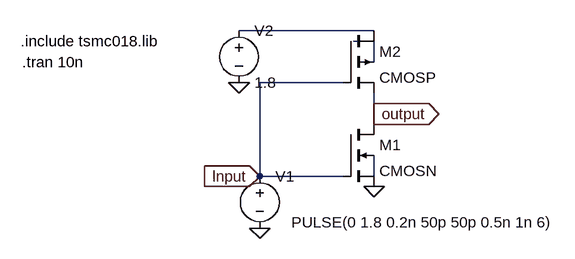
[diagram p0: schematic characteristic_of_cmos _inverter.asc]
characteristic_of_cmos _inverter.asc, the LTspice schematic file:
Version 4
SHEET 1 880 680
WIRE 224 -128 16 -128
WIRE 224 -112 192 -112
WIRE 224 -80 224 -112
WIRE 176 -48 48 -48
WIRE 224 0 224 -32
WIRE 224 16 224 0
WIRE 48 96 48 -48
WIRE 176 96 48 96
WIRE 224 96 224 64
FLAG 224 112 0
FLAG 16 -48 0
FLAG 48 176 0
FLAG 224 0 output
IOPIN 224 0 Out
FLAG 48 96 lnput
IOPIN 48 96 In
SYMBOL cmosn 176 16 R0
SYMATTR InstName M1
SYMATTR Value2 l=180n w=400n
SYMBOL cmosp 176 -128 R0
SYMATTR InstName M2
SYMATTR Value2 l=180n w=800n
SYMBOL voltage 48 80 R0
WINDOW 3 49 87 Left 2
WINDOW 123 0 0 Left 0
WINDOW 39 0 0 Left 0
SYMATTR InstName V1
SYMATTR Value PULSE(0 1.8 0.2n 50p 50p 0.5n 1n 6)
SYMBOL voltage 16 -144 R0
WINDOW 123 0 0 Left 0
WINDOW 39 0 0 Left 0
SYMATTR InstName V2
SYMATTR Value 1.8
TEXT -318 -80 Left 2 !.tran 10n
TEXT -320 -112 Left 2 !.include tsmc018.lib

The netlist it stands for:
* characteristic_of_cmos _inverter.asc
M1 output lnput 0 N003 CMOSN l=180n w=400n
M2 N001 lnput output N002 CMOSP l=180n w=800n
V1 lnput 0 PULSE(0 1.8 0.2n 50p 50p 0.5n 1n 6)
V2 N001 0 1.8
.model NMOS NMOS
.model PMOS PMOS
.lib standard.mos
.tran 10n
.include tsmc018.lib
.backanno
.end